# EAGLE design smallcircuit (EAGLE 7.5.0)
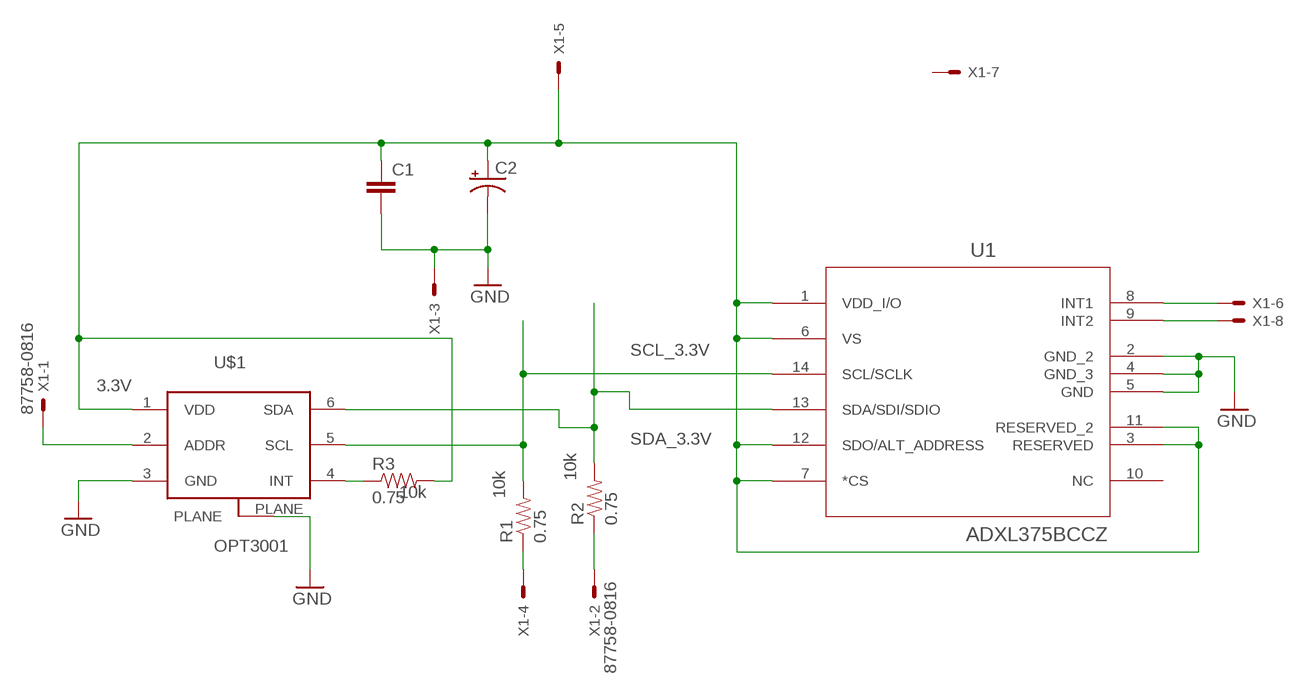
[diagram p0: schematic, sheet 1]

## Parts
C1  C-EUC0603  [C0603]
C2  CAP_POL3528  [EIA3528]
R1  0.75  0.75OHM-1/4W-1%(0805)  [0805]
R2  0.75  0.75OHM-1/4W-1%(0805)  [0805]
R3  0.75  0.75OHM-1/4W-1%(0805)  [0805]
U1  ADXL375BCCZ  [LGA_CC-14-1]
U$1  OPT3001  [OPT3001]
X1  87758-0816  [87758-0816]

## Nets
3.3V: C1.1 C2.A(+) R3.2 U1.1(VDD_I/O) U1.3(RESERVED) U1.6(VS) U1.7(*CS) U1.11(RESERVED_2) U1.12(SDO/ALT_ADDRESS) U$1.1(VDD) X1.5
GND: C1.2 C2.C(-) U1.2(GND_2) U1.4(GND_3) U1.5(GND) U$1.PLANE X1.3
N$1: U$1.2(ADDR) X1.1
N$2: R2.2 U1.13(SDA/SDI/SDIO) U$1.6(SDA)
N$3: U1.8(INT1) X1.6
N$4: R1.1 X1.4
N$5: R1.2 U1.14(SCL/SCLK) U$1.5(SCL)
N$6: R3.1 U$1.4(INT)
N$7: R2.1 X1.2
N$8: U1.9(INT2) X1.8
Unconnected: U1.10(NC) X1.7

## Notes on the sheet
- SCL_3.3V
- 3.3V
- SDA_3.3V
- 10k
- 10k | 10k

## Power pins joined to a net without a drawn wire
GND: U$1.3(GND)

## Library data of the parts
C1 = rcl:C-EU: CAPACITOR, European symbol
C2 = SparkFun-Passives:CAP_POL: Capacitor Polarized These are standard SMD and PTH capacitors. Normally 10uF, 47uF, and 100uF in electrolytic and tantalum varieties. Always verify the external diameter of the through hole cap, it varies with capacity, voltage, and manufacturer. The EIA devices should be standard.
R1-R3 = SparkFun-Resistors:0.75OHM-1/4W-1%(0805): RES-08474; PROD_ID: RES-08474
U1 = elements:ADXL375BCCZ
U$1 = datchiki:OPT3001
X1 = con-molex:87758-0816: 8 Pin - 2mm Dual Row Single Wafer, Vertical T/H HDR Source: http://www.molex.com/pdm_docs/sd/877580616_sd.pdf; MF: MOLEX; MPN: 87758-0816; OC_FARNELL: 7472331; OC_NEWARK: 59J1556

## Board
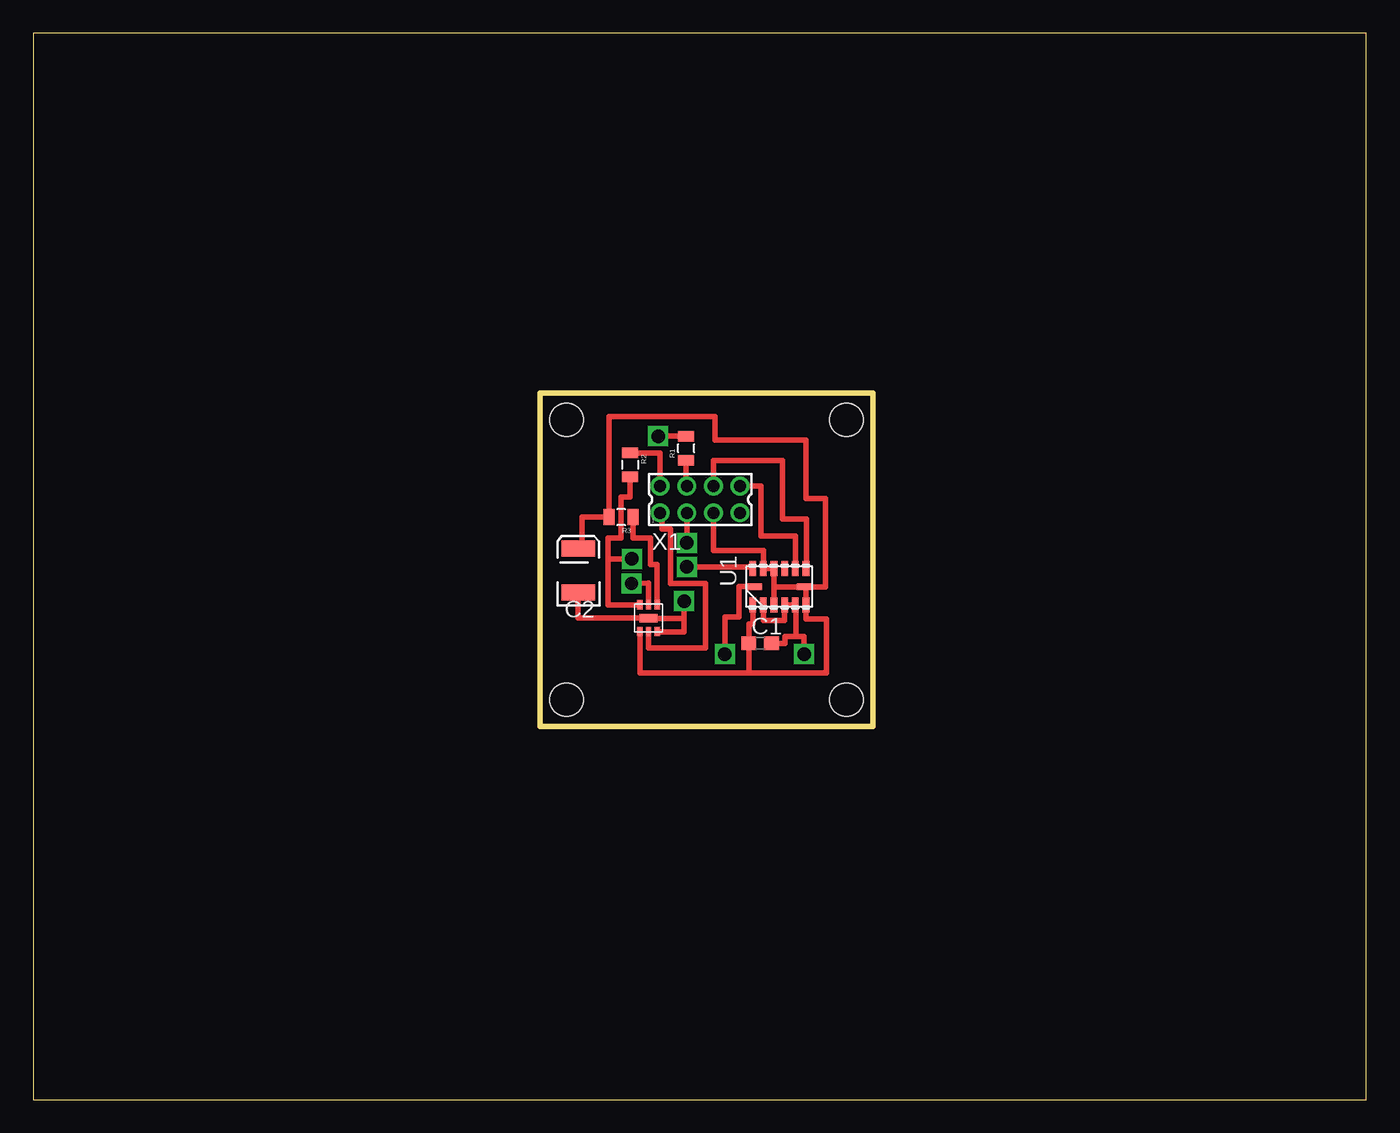
[diagram p1: board, top side]
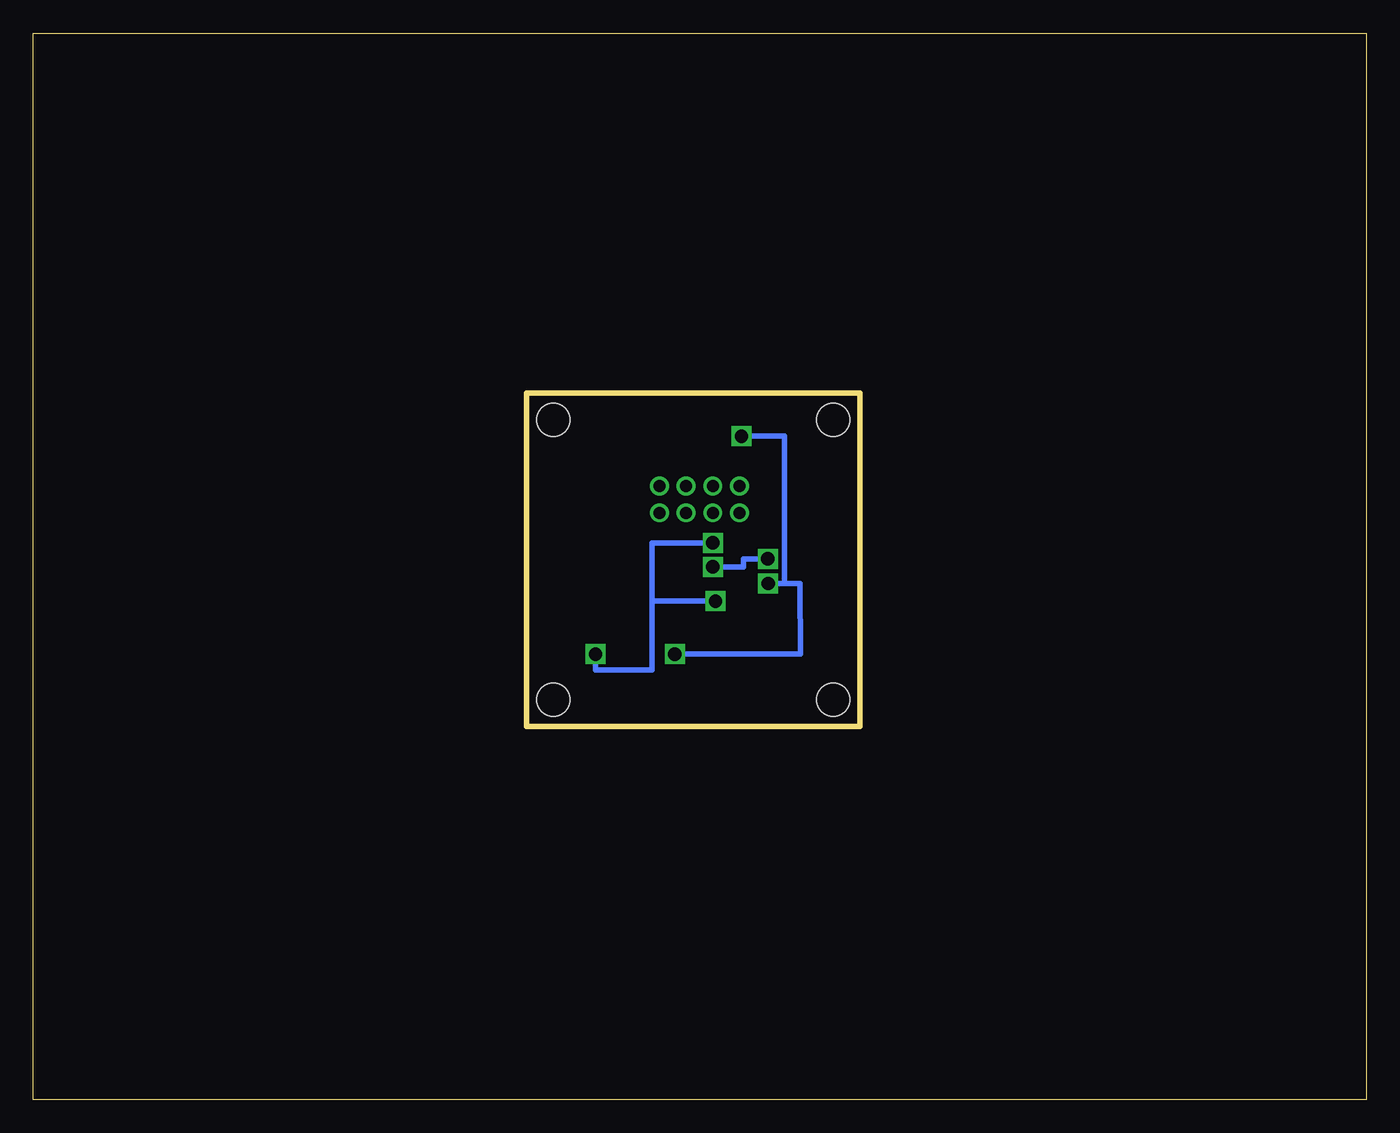
[diagram p2: board, bottom side, seen from below]

Size 100 x 80 mm. Coordinates in mm from the lower left corner, seen from the top.
Outline: 0,0 100,0 100,80 0,80 0,0
Outline: 38,53 63,53 63,28 38,28 38,53
Copper layers (1*16): Top 0.035mm / dielectric 1.5mm / Bottom 0.035mm
Design rules "default": minimum track width 10mil, minimum drill 24mil, track to track 8mil, track to pad 8mil, pad to pad 8mil, via to via 8mil, smd to smd 8mil, copper to edge 40mil, drill to drill 8mil, minimum pad ring 10mil, minimum via ring 8mil, stop-mask expansion 4mil, vias tented up to drill 0mil, thermal gap 10mil
Holes 2.5 mm at 40,51 61,51 40,30 61,30

### Footprints (pad centres in the part's own frame; a part is rotated, then mirrored left to right if it is on the bottom)
C0603 = smd 1.1 x 1: 1 -0.85,0; 2 0.85,0
EIA3528 = smd 1.2 x 2.5: A 1.65,0; C -1.65,0
0805 = smd 0.8 x 1.2: 1 -0.9,0; 2 0.9,0
LGA_CC-14-1 = smd 1.118 x 0.5: 1 -1.371,2; 2 -1.371,1.2; 3 -1.371,0.4; 4 -1.371,-0.4; 5 -1.371,-1.2; 6 -1.371,-2; 8 1.371,-2; 9 1.371,-1.2; 10 1.371,-0.4; 11 1.371,0.4; 12 1.371,1.2; 13 1.371,2 | smd 0.5 x 1.118: 7 0,-1.871; 14 0,1.871
OPT3001 = smd 0.7 x 0.4: 1 -1,0.65; 2 -1,0; 3 -1,-0.65; 4 1,-0.65; 5 1,0; 6 1,0.65 | smd 0.65 x 1.35: PLANE 0,0
87758-0816 = drill 0.9 pad 1.27: 1 -3,-1; 2 -3,1; 3 -1,-1; 4 -1,1; 5 1,-1; 6 1,1; 7 3,-1; 8 3,1

### Placement (x,y rotation side)
C1  54.52,34.23 0 top
C2  40.88,39.68 90 top
R1  48.98,48.87 90 top
R2  44.78,47.62 270 top
R3  44.09,43.7 180 top
U1  55.97,38.48 90 top
U$1  46.16,36.12 90 top
X1  50.02,45.02 0 top

### Tracks (layer width: path | path; a pad name or v marks a point on that pad's centre or on a via)
3.3V
  Top 0.254: 55.56,37.92 55.56,37.95
  Top 0.406: 53.67,32 45.51,32 U$1.1 | U1.7 57.83,38.48 55.56,38.48 | U1.3 55.56,37.95 55.56,38.48 | 55.56,38.48 U1.11 U1.12 54.77,41.2 51.02,41.2 X1.5 | U1.7 57.97,38.48 U1.6 57.97,36.05 59.5,36.05 59.5,32 53.67,32 | 53.67,32 C1.1 53.67,35.67 54,35.67 54,37.11 U1.1 | C2.A 41.15,41.33 41.15,43.73 42.4,43.73 R3.2 43.2,51.25 51.15,51.25 51.15,49.5 57.98,49.5 57.98,45.1 59.42,45.1 59.42,38.48 U1.7
GND  (via drill 1)
  Top 0.406: 54.73,37.11 U1.2 54.77,35.95 56.37,35.95 U1.4 U1.5 57.2,37.11 57.2,34.75 | 57.2,34.75 56.4,34.75 56.4,34.23 C1.2 | C2.C 40.88,36.12 U$1.PLANE 46.16,36.1 48.83,36.1 | U$1.3 46.8,35.08 48.83,35.08 48.83,36.1 | 48.83,36.1 v48.83,37.4 | v57.83,33.42 57.83,34.75 57.2,34.75 | X1.3 v49.02,41.77
  Bottom 0.406: v57.83,33.42 57.83,32.23 53.6,32.23 53.6,37.4 53.58,37.4 | v48.83,37.4 53.58,37.4 | v49.02,41.77 53.58,41.77 53.58,37.4
N$1
  Top 0.406: U$1.2 46.15,33.9 50.42,33.9 50.42,38.73 47.8,38.73 47.8,42.83 47.15,42.83 47.15,44.02 X1.1
N$2  (via drill 1)
  Top 0.406: 43.12,40.58 v44.9,40.58 | 43.12,40.58 43.12,37.12 U$1.6 | 43.12,40.58 43.12,42.12 44.1,42.12 44.1,45.23 44.78,45.23 R2.2 | U1.13 53.97,39.98 v49.02,39.98
  Bottom 0.406: v44.9,40.58 46.73,40.58 46.73,39.98 v49.02,39.98
N$3
  Top 0.406: U1.8 58,39.86 58,43.55 56.2,43.55 56.2,47.95 51.02,47.95 X1.6
N$4
  Top 0.406: X1.4 48.98,46.02 R1.1
N$5  (via drill 1)
  Top 0.406: v44.88,38.73 46.16,38.75 U$1.5 | R1.2 47.12,49.77 v46.88,49.77 | v51.88,33.42 51.88,36.23 52.92,36.23 52.92,38.48 U1.14
  Bottom 0.406: v44.88,38.73 43.66,38.71 | 43.66,38.71 42.48,38.73 42.45,33.42 v51.88,33.42 | v46.88,49.77 43.66,49.77 43.66,38.71
N$6
  Top 0.406: U$1.4 46.8,40.15 46.3,40.15 46.3,42.12 44.99,42.12 R3.1
N$7
  Top 0.406: R2.1 47.02,48.52 X1.2
N$8
  Top 0.406: X1.8 54.58,46.02 54.58,42.3 57.16,42.3 U1.9